# EasyEDA Pro project ProProject_无线温湿度检测系统1_2024-10-27.epro, board PCB3
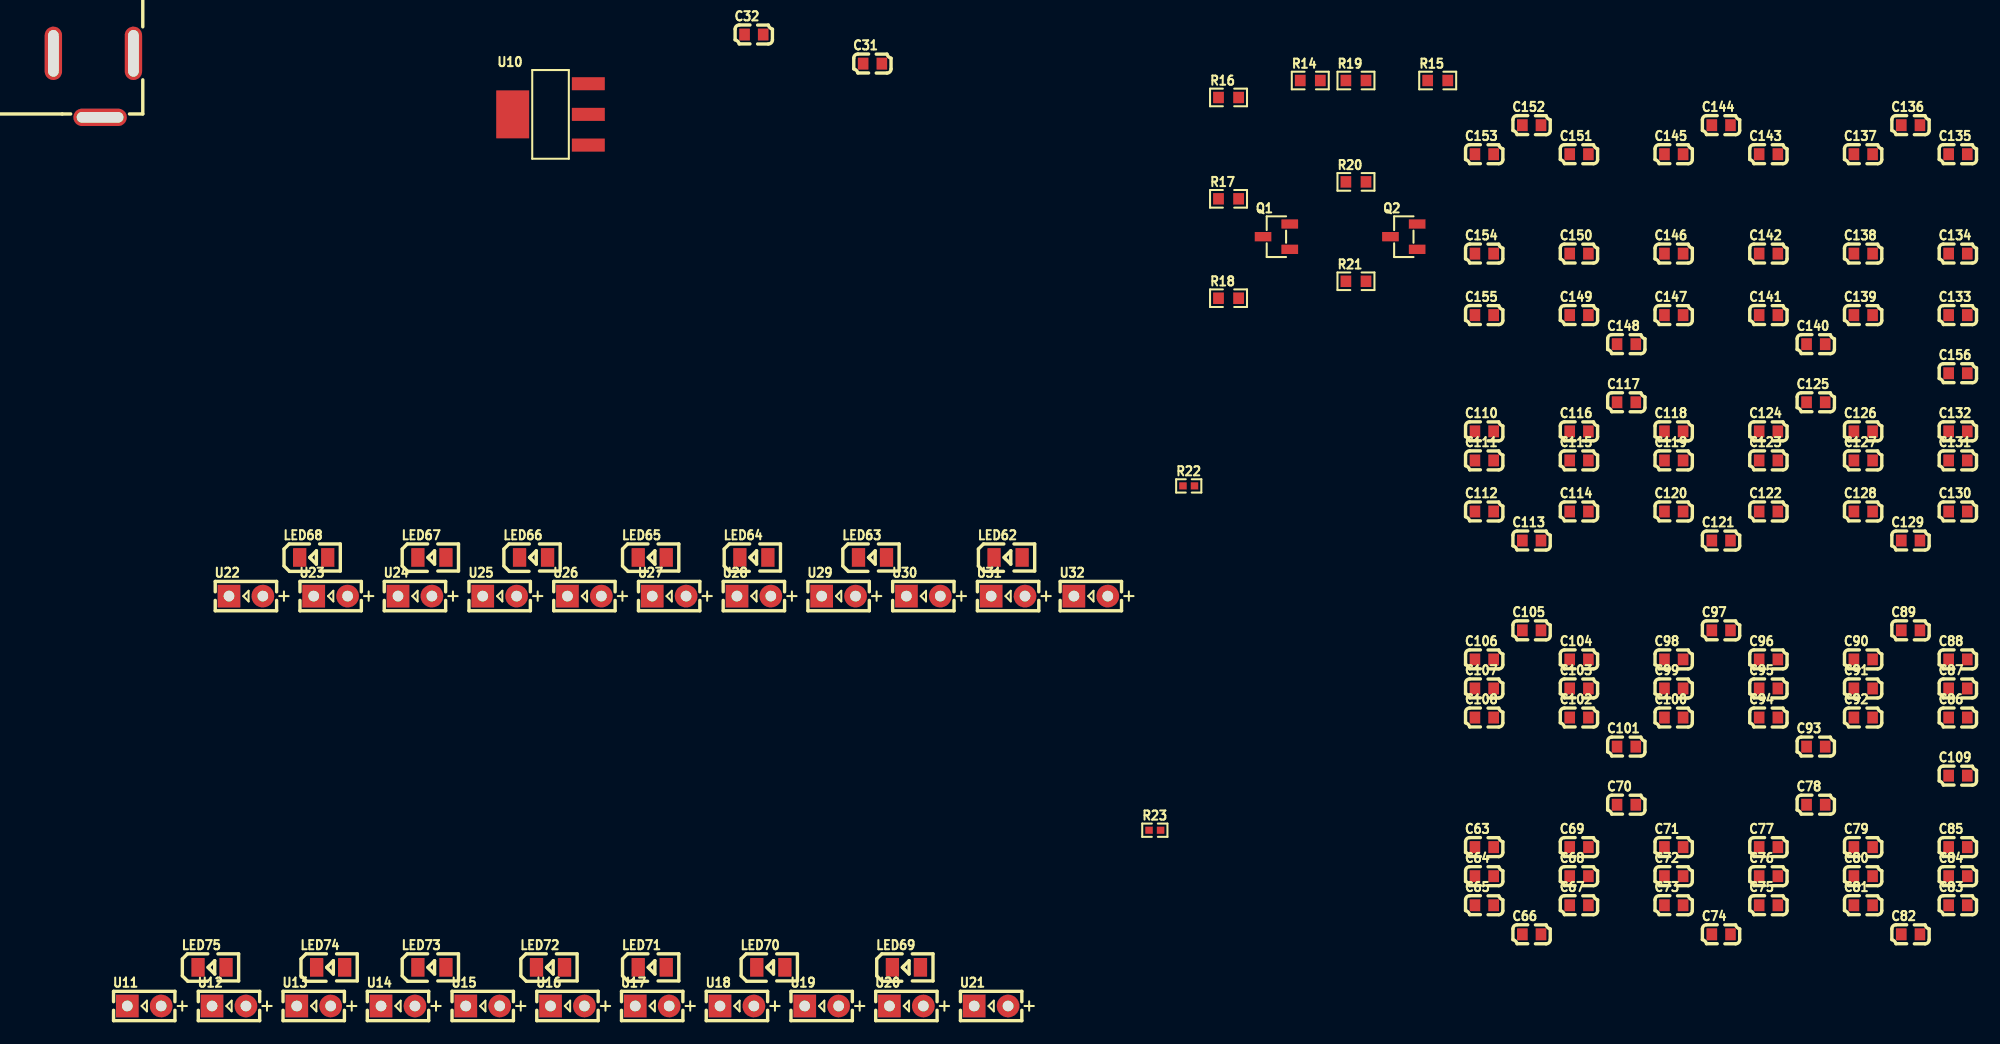
[diagram p13: board, top side]
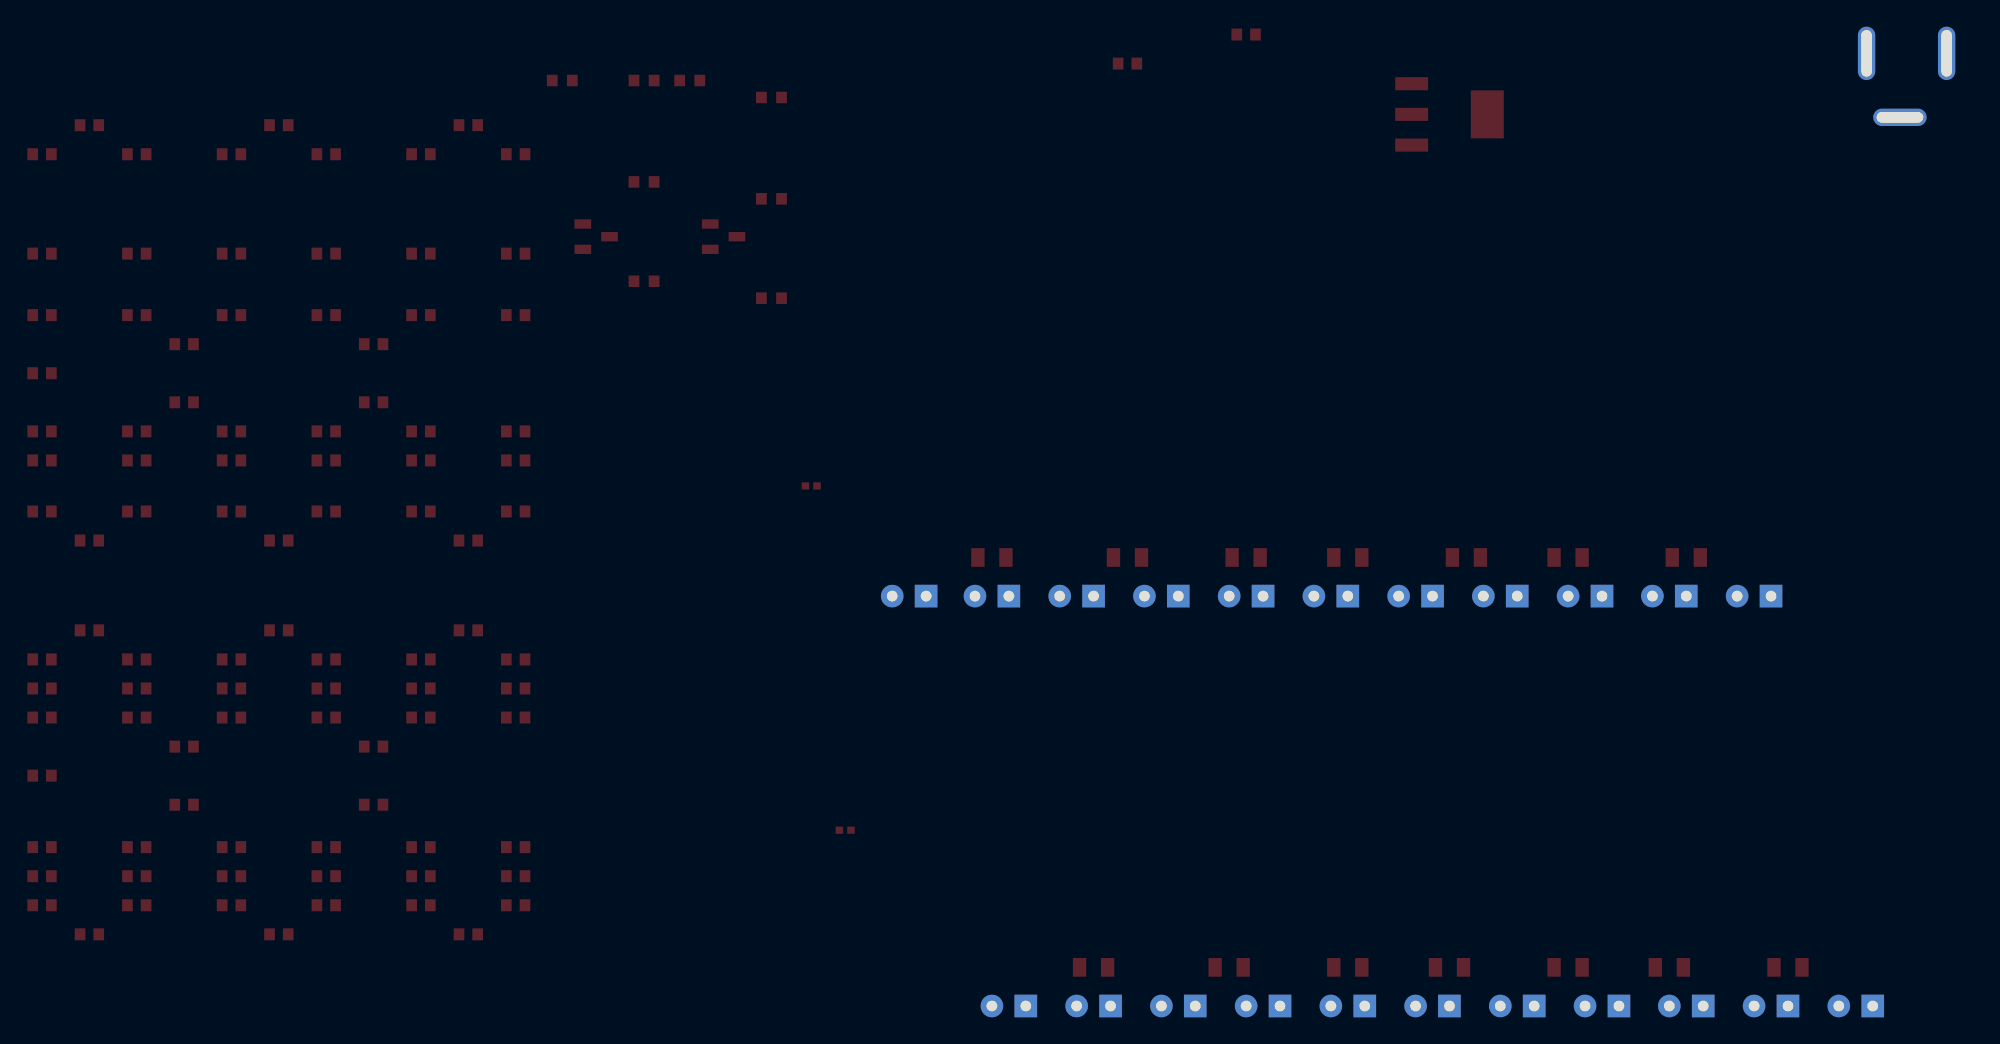
[diagram p14: board, bottom side, seen from below]

No outline. copper layers: Top Layer, Bottom Layer. Coordinates in mm from the lowest, leftmost part position.
Stack: Top Layer 0.035mm / Dielectric1 1.51mm FR4 er 4.5 / Bottom Layer 0.035mm

## Design rules (mm)
template: JLCPCB Capability(Two Layers Board)
spacing copperThickness1oz (default): track to track 0.102, other pairs 0.152 to 0.3
spacing copperThickness2oz: track to track 0.203, other pairs 0.152 to 0.3
track width copperThickness1oz (default): min 0.127, default 0.254, max 2.54
track width copperThickness2oz: min 0.203, default 0.254, max 2.54
differential pair differentialPair (default): width min 0.127, default 0.254, max 2.54; gap min 0.152, default 0.152
via viaSize (default): diameter min 0.5, default 0.61, max 10; hole min 0.3, default 0.305, max 6.3

## Placement (name value [footprint] x y rotation side)
C31  1uF  [C0603]  58.39 70.68 0 top
C32  1uF  [C0603]  49.5 72.86 0 top
C63  1uF  [C0603]  104.24 11.91 0 top
C64  1uF  [C0603]  104.24 9.73 0 top
C65  1uF  [C0603]  104.24 7.56 0 top
C66  1uF  [C0603]  107.78 5.38 0 top
C67  1uF  [C0603]  111.33 7.56 0 top
C68  1uF  [C0603]  111.33 9.73 0 top
C69  1uF  [C0603]  111.33 11.91 0 top
C70  1uF  [C0603]  114.88 15.1 0 top
C71  1uF  [C0603]  118.43 11.91 0 top
C72  1uF  [C0603]  118.43 9.73 0 top
C73  1uF  [C0603]  118.43 7.56 0 top
C74  1uF  [C0603]  121.98 5.38 0 top
C75  1uF  [C0603]  125.53 7.56 0 top
C76  1uF  [C0603]  125.53 9.73 0 top
C77  1uF  [C0603]  125.53 11.91 0 top
C78  1uF  [C0603]  129.08 15.1 0 top
C79  1uF  [C0603]  132.63 11.91 0 top
C80  1uF  [C0603]  132.63 9.73 0 top
C81  1uF  [C0603]  132.63 7.56 0 top
C82  1uF  [C0603]  136.18 5.38 0 top
C83  1uF  [C0603]  139.73 7.56 0 top
C84  1uF  [C0603]  139.73 9.73 0 top
C85  1uF  [C0603]  139.73 11.91 0 top
C86  1uF  [C0603]  139.73 21.63 0 top
C87  1uF  [C0603]  139.73 23.81 0 top
C88  1uF  [C0603]  139.73 25.99 0 top
C89  1uF  [C0603]  136.18 28.17 0 top
C90  1uF  [C0603]  132.63 25.99 0 top
C91  1uF  [C0603]  132.63 23.81 0 top
C92  1uF  [C0603]  132.63 21.63 0 top
C93  1uF  [C0603]  129.08 19.45 0 top
C94  1uF  [C0603]  125.53 21.63 0 top
C95  1uF  [C0603]  125.53 23.81 0 top
C96  1uF  [C0603]  125.53 25.99 0 top
C97  1uF  [C0603]  121.98 28.17 0 top
C98  1uF  [C0603]  118.43 25.99 0 top
C99  1uF  [C0603]  118.43 23.81 0 top
C100  1uF  [C0603]  118.43 21.63 0 top
C101  1uF  [C0603]  114.88 19.45 0 top
C102  1uF  [C0603]  111.33 21.63 0 top
C103  1uF  [C0603]  111.33 23.81 0 top
C104  1uF  [C0603]  111.33 25.99 0 top
C105  1uF  [C0603]  107.78 28.17 0 top
C106  1uF  [C0603]  104.24 25.99 0 top
C107  1uF  [C0603]  104.24 23.81 0 top
C108  1uF  [C0603]  104.24 21.63 0 top
C109  1uF  [C0603]  139.73 17.28 0 top
C110  1uF  [C0603]  104.24 43.1 0 top
C111  1uF  [C0603]  104.24 40.92 0 top
C112  1uF  [C0603]  104.24 37.09 0 top
C113  1uF  [C0603]  107.78 34.91 0 top
C114  1uF  [C0603]  111.33 37.09 0 top
C115  1uF  [C0603]  111.33 40.92 0 top
C116  1uF  [C0603]  111.33 43.1 0 top
C117  1uF  [C0603]  114.88 45.28 0 top
C118  1uF  [C0603]  118.43 43.1 0 top
C119  1uF  [C0603]  118.43 40.92 0 top
C120  1uF  [C0603]  118.43 37.09 0 top
C121  1uF  [C0603]  121.98 34.91 0 top
C122  1uF  [C0603]  125.53 37.09 0 top
C123  1uF  [C0603]  125.53 40.92 0 top
C124  1uF  [C0603]  125.53 43.1 0 top
C125  1uF  [C0603]  129.08 45.28 0 top
C126  1uF  [C0603]  132.63 43.1 0 top
C127  1uF  [C0603]  132.63 40.92 0 top
C128  1uF  [C0603]  132.63 37.09 0 top
C129  1uF  [C0603]  136.18 34.91 0 top
C130  1uF  [C0603]  139.73 37.09 0 top
C131  1uF  [C0603]  139.73 40.92 0 top
C132  1uF  [C0603]  139.73 43.1 0 top
C133  1uF  [C0603]  139.73 51.81 0 top
C134  1uF  [C0603]  139.73 56.43 0 top
C135  1uF  [C0603]  139.73 63.88 0 top
C136  1uF  [C0603]  136.18 66.06 0 top
C137  1uF  [C0603]  132.63 63.88 0 top
C138  1uF  [C0603]  132.63 56.43 0 top
C139  1uF  [C0603]  132.63 51.81 0 top
C140  1uF  [C0603]  129.08 49.63 0 top
C141  1uF  [C0603]  125.53 51.81 0 top
C142  1uF  [C0603]  125.53 56.43 0 top
C143  1uF  [C0603]  125.53 63.88 0 top
C144  1uF  [C0603]  121.98 66.06 0 top
C145  1uF  [C0603]  118.43 63.88 0 top
C146  1uF  [C0603]  118.43 56.43 0 top
C147  1uF  [C0603]  118.43 51.81 0 top
C148  1uF  [C0603]  114.88 49.63 0 top
C149  1uF  [C0603]  111.33 51.81 0 top
C150  1uF  [C0603]  111.33 56.43 0 top
C151  1uF  [C0603]  111.33 63.88 0 top
C152  1uF  [C0603]  107.78 66.06 0 top
C153  1uF  [C0603]  104.24 63.88 0 top
C154  1uF  [C0603]  104.24 56.43 0 top
C155  1uF  [C0603]  104.24 51.81 0 top
C156  1uF  [C0603]  139.73 47.46 0 top
DC1  DC-005 2.0  [DC-IN-TH_DC-5520-1]  0 69.05 0 top
LED62  NCD0805R1  [LED0805-R-RD]  68.55 33.64 0 top
LED63  NCD0805R1  [LED0805-R-RD]  58.39 33.64 0 top
LED64  NCD0805R1  [LED0805-R-RD]  49.5 33.64 0 top
LED65  NCD0805R1  [LED0805-R-RD]  41.88 33.64 0 top
LED66  NCD0805R1  [LED0805-R-RD]  32.99 33.64 0 top
LED67  NCD0805R1  [LED0805-R-RD]  25.37 33.64 0 top
LED68  NCD0805R1  [LED0805-R-RD]  16.51 33.64 0 top
LED69  NCD0805R1  [LED0805-R-RD]  60.93 2.9 0 top
LED70  NCD0805R1  [LED0805-R-RD]  50.77 2.9 0 top
LED71  NCD0805R1  [LED0805-R-RD]  41.88 2.9 0 top
LED72  NCD0805R1  [LED0805-R-RD]  34.26 2.9 0 top
LED73  NCD0805R1  [LED0805-R-RD]  25.37 2.9 0 top
LED74  NCD0805R1  [LED0805-R-RD]  17.78 2.9 0 top
LED75  NCD0805R1  [LED0805-R-RD]  8.89 2.9 0 top
Q1  MMBT3904  [SOT-23-3_L2.9-W1.3-P1.90-LS2.4-BR]  88.65 57.7 0 top
Q2  MMBT3904  [SOT-23-3_L2.9-W1.3-P1.90-LS2.4-BR]  98.2 57.7 0 top
R14  510Ω  [R0603]  91.19 69.41 0 top
R15  510Ω  [R0603]  100.74 69.41 0 top
R16  10kΩ  [R0603]  85.07 68.14 0 top
R17  10kΩ  [R0603]  85.07 60.54 0 top
R18  10kΩ  [R0603]  85.07 53.08 0 top
R19  10kΩ  [R0603]  94.62 69.41 0 top
R20  10kΩ  [R0603]  94.62 61.81 0 top
R21  10kΩ  [R0603]  94.62 54.35 0 top
R22  0Ω  [R0402]  82.08 39.01 0 top
R23  0Ω  [R0402]  79.54 13.18 0 top
U10  AMS1117-3.3  [SOT-223-4_L6.5-W3.5-P2.30-LS7.0-BR]  34.26 66.87 0 top
U11  LVS3SRD066G  [LED-TH_L3.2-W2.0-P2.54-RD]  3.81 0 0 top
U12  LVS3SRD066G  [LED-TH_L3.2-W2.0-P2.54-RD]  10.16 0 0 top
U13  LVS3SRD066G  [LED-TH_L3.2-W2.0-P2.54-RD]  16.51 0 0 top
U14  LVS3SRD066G  [LED-TH_L3.2-W2.0-P2.54-RD]  22.83 0 0 top
U15  LVS3SRD066G  [LED-TH_L3.2-W2.0-P2.54-RD]  29.18 0 0 top
U16  LVS3SRD066G  [LED-TH_L3.2-W2.0-P2.54-RD]  35.53 0 0 top
U17  LVS3SRD066G  [LED-TH_L3.2-W2.0-P2.54-RD]  41.88 0 0 top
U18  LVS3SRD066G  [LED-TH_L3.2-W2.0-P2.54-RD]  48.23 0 0 top
U19  LVS3SRD066G  [LED-TH_L3.2-W2.0-P2.54-RD]  54.58 0 0 top
U20  LVS3SRD066G  [LED-TH_L3.2-W2.0-P2.54-RD]  60.93 0 0 top
U21  LVS3SRD066G  [LED-TH_L3.2-W2.0-P2.54-RD]  67.28 0 0 top
U22  LVS3SRD066G  [LED-TH_L3.2-W2.0-P2.54-RD]  11.43 30.74 0 top
U23  LVS3SRD066G  [LED-TH_L3.2-W2.0-P2.54-RD]  17.78 30.74 0 top
U24  LVS3SRD066G  [LED-TH_L3.2-W2.0-P2.54-RD]  24.1 30.74 0 top
U25  LVS3SRD066G  [LED-TH_L3.2-W2.0-P2.54-RD]  30.45 30.74 0 top
U26  LVS3SRD066G  [LED-TH_L3.2-W2.0-P2.54-RD]  36.8 30.74 0 top
U27  LVS3SRD066G  [LED-TH_L3.2-W2.0-P2.54-RD]  43.15 30.74 0 top
U28  LVS3SRD066G  [LED-TH_L3.2-W2.0-P2.54-RD]  49.5 30.74 0 top
U29  LVS3SRD066G  [LED-TH_L3.2-W2.0-P2.54-RD]  55.85 30.74 0 top
U30  LVS3SRD066G  [LED-TH_L3.2-W2.0-P2.54-RD]  62.2 30.74 0 top
U31  LVS3SRD066G  [LED-TH_L3.2-W2.0-P2.54-RD]  68.55 30.74 0 top
U32  LVS3SRD066G  [LED-TH_L3.2-W2.0-P2.54-RD]  74.75 30.74 0 top

## Footprints (pads in the part's own frame, mm; a bottom-side part is the same pattern mirrored in y, then rotated)
C0603
  rect 0.8x0.9 smd: 1(-0.7,0) 2(0.7,0)
DC-IN-TH_DC-5520-1
  oval 4x1.3 hole 3.5x0.8: 2(0.5,-2.4)
  oval 1.3x4 hole 0.8x3.5: 3(-3,2.4) 4(3,2.4)
LED0805-R-RD
  rect 1x1.399 smd: 1(1.05,0) 2(-1.05,0)
LED-TH_L3.2-W2.0-P2.54-RD
  rect 1.7x1.7 hole 0.8: 1(-1.27,0)
  round 1.7 hole 0.8: 2(1.27,0)
R0402
  rect 0.566x0.54 smd: 1(-0.433,0) 2(0.433,0)
R0603
  rect 0.806x0.864 smd: 1(-0.753,0) 2(0.753,0)
SOT-23-3_L2.9-W1.3-P1.90-LS2.4-BR
  rect 1.25x0.7 smd: 1(1,-0.95) 2(1,0.95) 3(-1,0)
SOT-223-4_L6.5-W3.5-P2.30-LS7.0-BR
  rect 2.47x0.98 smd: 1(2.835,-2.3) 2(2.835,0) 3(2.835,2.3)
  rect 2.47x3.6 smd: 4(-2.835,0)

## Nets
As in the schematic.
